# Altium schematic sheet PV_Relay.SchDoc
size A4; SheetNumber: 8; SheetTotal: 13
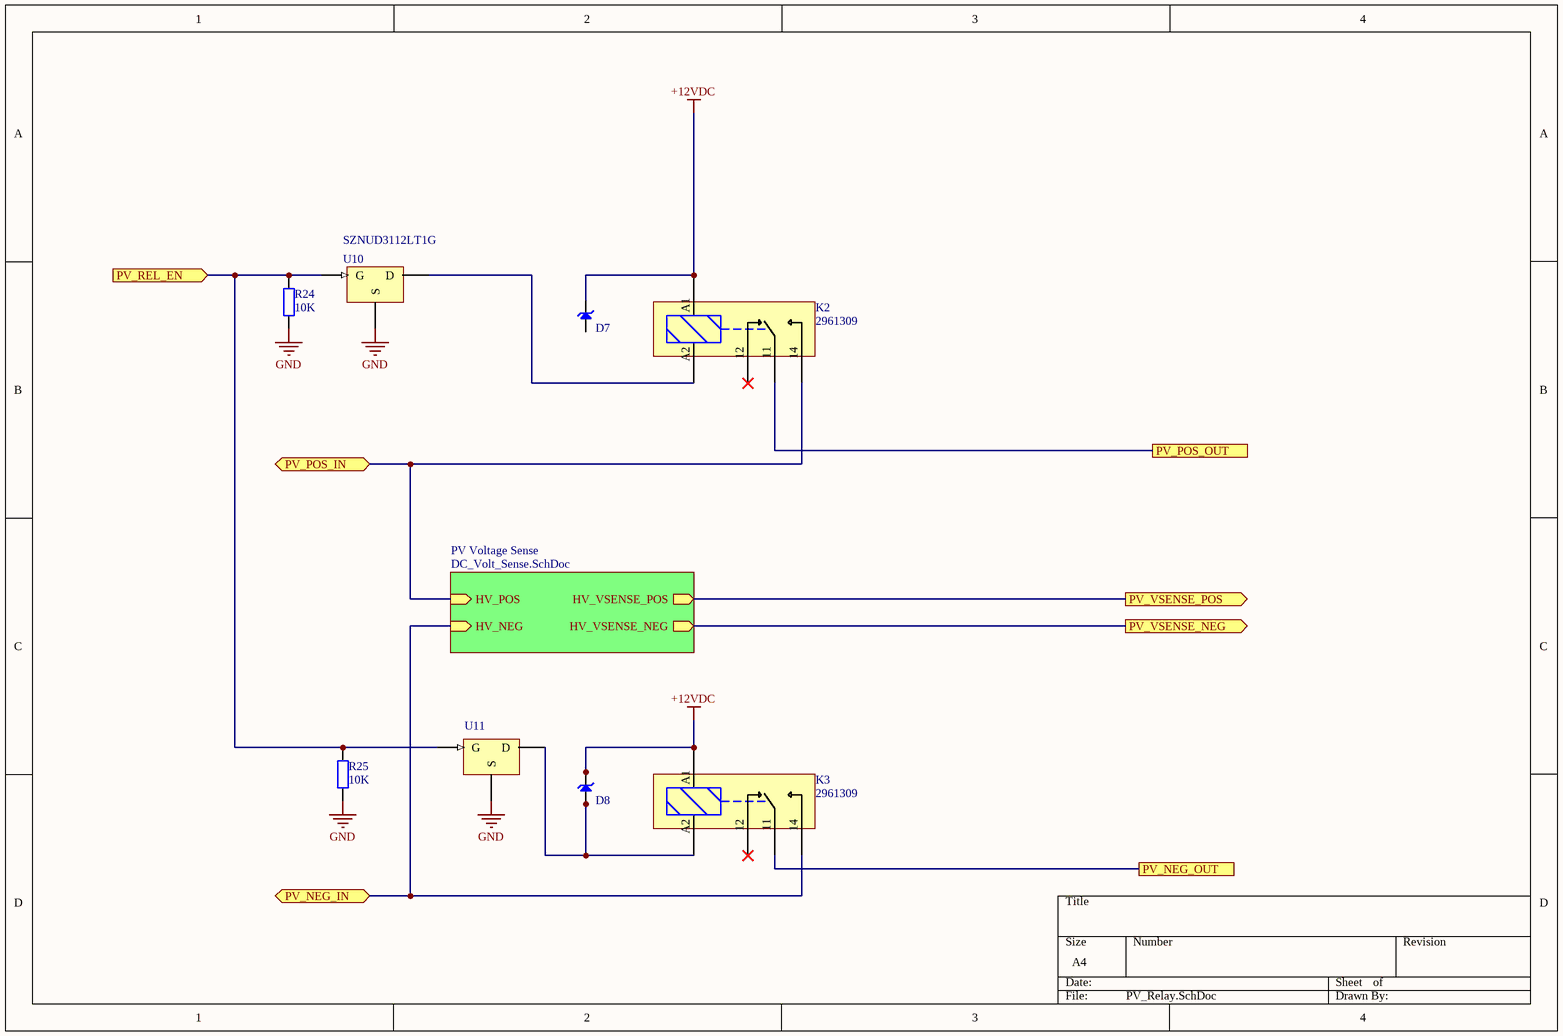
[diagram p0: PV_Relay.SchDoc]

## Parts
D7  SMF16A  [SOD-123H]  (value not drawn)
D8  SMF16A  [SOD-123H]  (value not drawn)
K2  2961309  [2961309]
K3  2961309  [2961309]
R24  10K  [RES 0603/1608]
R25  10K  [RES 0603/1608]
U10  SZNUD3112LT1G  [SZNUD3112LT1G]
U11  SZNUD3112LT1G  [SZNUD3112LT1G]  (value not drawn)

## Sub-sheets
PV Voltage Sense = DC_Volt_Sense.SchDoc: HV_VSENSE_NEG (out), HV_POS (in), HV_VSENSE_POS (out), HV_NEG (in)

## Ports
PV_NEG_IN (bidir), PV_NEG_OUT, PV_POS_IN (bidir), PV_POS_OUT, PV_REL_EN (in), PV_VSENSE_NEG (out), PV_VSENSE_POS (out)

## Nets
+12VDC: D7.K D8.K K2.A1 K3.A1
GND: R24.1 R25.1 U10.2(S) U11.2(S)
PV_NEG_IN: K3.14 ; port PV_NEG_IN, sheet PV Voltage Sense/HV_NEG
PV_NEG_OUT: K3.11 ; port PV_NEG_OUT
PV_POS_IN: K2.14 ; port PV_POS_IN, sheet PV Voltage Sense/HV_POS
PV_POS_OUT: K2.11 ; port PV_POS_OUT
PV_REL_EN: R24.2 R25.2 U10.1(G) U11.1(G) ; port PV_REL_EN
PV_VSENSE_NEG: port PV_VSENSE_NEG, sheet PV Voltage Sense/HV_VSENSE_NEG
PV_VSENSE_POS: port PV_VSENSE_POS, sheet PV Voltage Sense/HV_VSENSE_POS
NetD8_A: D8.A K3.A2 U11.3(D)
NetK2_A2: K2.A2 U10.3(D)

Not connected (* = marked no-connect by the designer): D7 A; K2 12(16)*; K3 12(16)*

## Library data of the parts
D7 D8 = SMF16A: Zener Diode; manufacturer: Littelfuse Inc.; Maximun Temperature: 150; Minimum Temperature: -55; Voltage: 16V; inventory_price: 0.36; partnumber: SMF16A; Manufacturer Part Number: SMF16A; URL Datasheet: https://www.littelfuse.com/~/media/electronics/datasheets/tvs_diodes/littelfuse_tvs_diode_smf_datasheet.pdf.pdf; parttype: TVS - Diodes
K2 K3 = 2961309: Plug-in miniature power relay, with power contact for high continuous currents, 1 changeover contact, input voltage 12 V DC
R24 R25 = RC0603FR-0710KL: RES SMD 10K OHM 1% 1/10W 0603; Manufacturer: Yageo; Package Imperial: 0603; Package Metric: 1608; Temperature Coefficient: ±100ppm/°C; Power (Watts): 0.1W, 1/10W; Part Number: RC0603FR-0710KL; Value: 10K; Tolerance: ±1%; Digi-Key Part Number: 311-10.0KHRCT-ND
U10 U11 = SZNUD3112LT1GOSCT-ND: manufacturer: ON Semiconductor; inventory_price: 0.93; partnumber: SZNUD3112LT1GOSCT-ND; Manufacturer Part Number: SZNUD3112LT1GOSCT-ND; URL Datasheet: https://www.onsemi.com/pdf/datasheet/nud3112-d.pdf; parttype: PMIC - Power Distribution Switches, Load Drivers